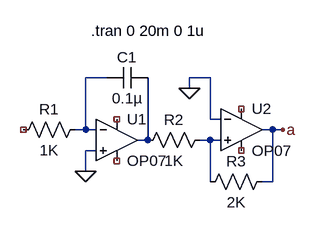
[diagram p0: schematic Versuch6sim.asc]
Versuch6sim.asc, the LTspice schematic file:
Version 4
SHEET 1 880 680
WIRE 208 16 176 16
WIRE 368 16 336 16
WIRE 336 32 336 16
WIRE 368 80 368 16
WIRE 384 80 368 80
WIRE 176 96 176 16
WIRE 176 96 160 96
WIRE 192 96 176 96
WIRE 464 96 448 96
WIRE 480 96 464 96
WIRE 272 112 272 16
WIRE 272 112 256 112
WIRE 368 112 352 112
WIRE 384 112 368 112
WIRE 192 128 176 128
WIRE 176 160 176 128
WIRE 368 176 368 112
WIRE 464 176 464 96
WIRE 464 176 448 176
FLAG 176 160 0
FLAG 336 32 0
FLAG 480 96 a
SYMBOL res 176 80 R90
WINDOW 0 0 56 VBottom 2
WINDOW 3 32 56 VTop 2
SYMATTR InstName R1
SYMATTR Value 1K
SYMATTR SpiceLine tol=1 pwr=0.1
SYMBOL cap 272 0 R90
WINDOW 0 0 32 VBottom 2
WINDOW 3 32 32 VTop 2
SYMATTR InstName C1
SYMATTR Value 0.1µ
SYMATTR SpiceLine V=10 Irms=0 Rser=0 Lser=0 mfg="Murata" pn="GCM155R71A104KA55" type="X7R"
SYMBOL res 368 96 R90
WINDOW 0 0 56 VBottom 2
WINDOW 3 32 56 VTop 2
SYMATTR InstName R2
SYMATTR Value 1K
SYMATTR SpiceLine tol=1 pwr=0.1
SYMBOL res 464 160 R90
WINDOW 0 0 56 VBottom 2
WINDOW 3 32 56 VTop 2
SYMATTR InstName R3
SYMATTR Value 2K
SYMATTR SpiceLine tol=1 pwr=0.1
SYMBOL Opamps\\OP07 224 48 R0
SYMATTR InstName U1
SYMBOL Opamps\\OP07 416 32 R0
SYMATTR InstName U2
TEXT 184 -56 Left 2 !.tran 0 20m 0 1u

The netlist it stands for:
* Versuch6sim.asc
R1 N001 NC_01 1K tol=1 pwr=0.1
C1 N002 N001 0.1µ V=10 Irms=0 Rser=0 Lser=0 mfg="Murata" pn="GCM155R71A104KA55" type="X7R"
R2 N003 N002 1K tol=1 pwr=0.1
R3 a N003 2K tol=1 pwr=0.1
XU1 0 N001 NC_02 NC_03 N002 LT1001  ; OP07, pins In+ In- V+ V- OUT
XU2 N003 0 NC_04 NC_05 a LT1001  ; OP07, pins In+ In- V+ V- OUT
.tran 0 20m 0 1u
.lib LTC.lib
.backanno
.end